# Altium project Altium_008_ESCDesign30ABidirectional.PrjPcb
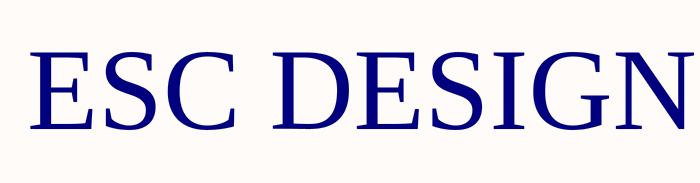
[diagram p0: Introduction.SchDoc]
6 sheets, 69 parts. Net scope: flat (ports and power ports of the same name join across sheets).
Board file: PCB1.PcbDoc
Sheets:
  Introduction.SchDoc
  General Schematics of Design.SchDoc
  Buck Converter and BEC Systems.SchDoc
  MosfetDrivers.SchDoc
  Stm32F103C8T6.SchDoc
  Atmega328PB.SchDoc

## Sheet Introduction.SchDoc
size 420 x 297 mm; Author: Denizhan ALTAY; SheetNumber: 1; SheetTotal: 4

### Notes on the sheet
- ESC DESIGN
- THIS DOCUMENT AND THE DATA DISCLOSED HEREIN OR
- HEREWITH IS THE PROPERTY OF ALTIUM LIMITED AND MAY
- BE FREELY DISTRIBUTED IN WHOLE. NO RIGHTS ARE
- RESERVED OR EXPRESS OR IMPLIED WARANTEE GIVEN.
- Title :
- Size :
- Date :
- A3
- Sheet Number :
- Time :
- Revision :
- Author :
- File :

## Sheet General Schematics of Design.SchDoc
size 420 x 297 mm; SheetNumber: 2; SheetTotal: 6
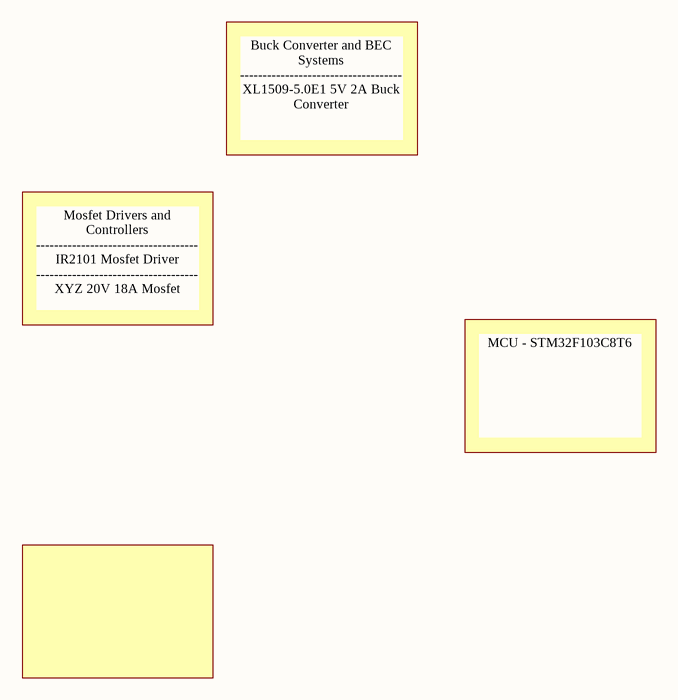
[diagram p1: General Schematics of Design.SchDoc]

### Notes on the sheet
- Buck Converter and BEC Systems ------------------------------------                                                 XL1509-5.0E1 5V 2A Buck Converter
- Mosfet Drivers and Controllers ------------------------------------    IR2101 Mosfet Driver ------------------------------------ XYZ 20V 18A Mosfet
- MCU - STM32F103C8T6
- THIS DOCUMENT AND THE DATA DISCLOSED HEREIN OR
- HEREWITH IS THE PROPERTY OF ALTIUM LIMITED AND MAY
- BE FREELY DISTRIBUTED IN WHOLE. NO RIGHTS ARE
- RESERVED OR EXPRESS OR IMPLIED WARANTEE GIVEN.
- Title :
- Size :
- Date :
- A3
- Sheet Number :
- Time :
- Revision :
- Author :
- File :

## Sheet Buck Converter and BEC Systems.SchDoc
size 420 x 297 mm; Author: Denizhan ALTAY; SheetNumber: 3; SheetTotal: 6
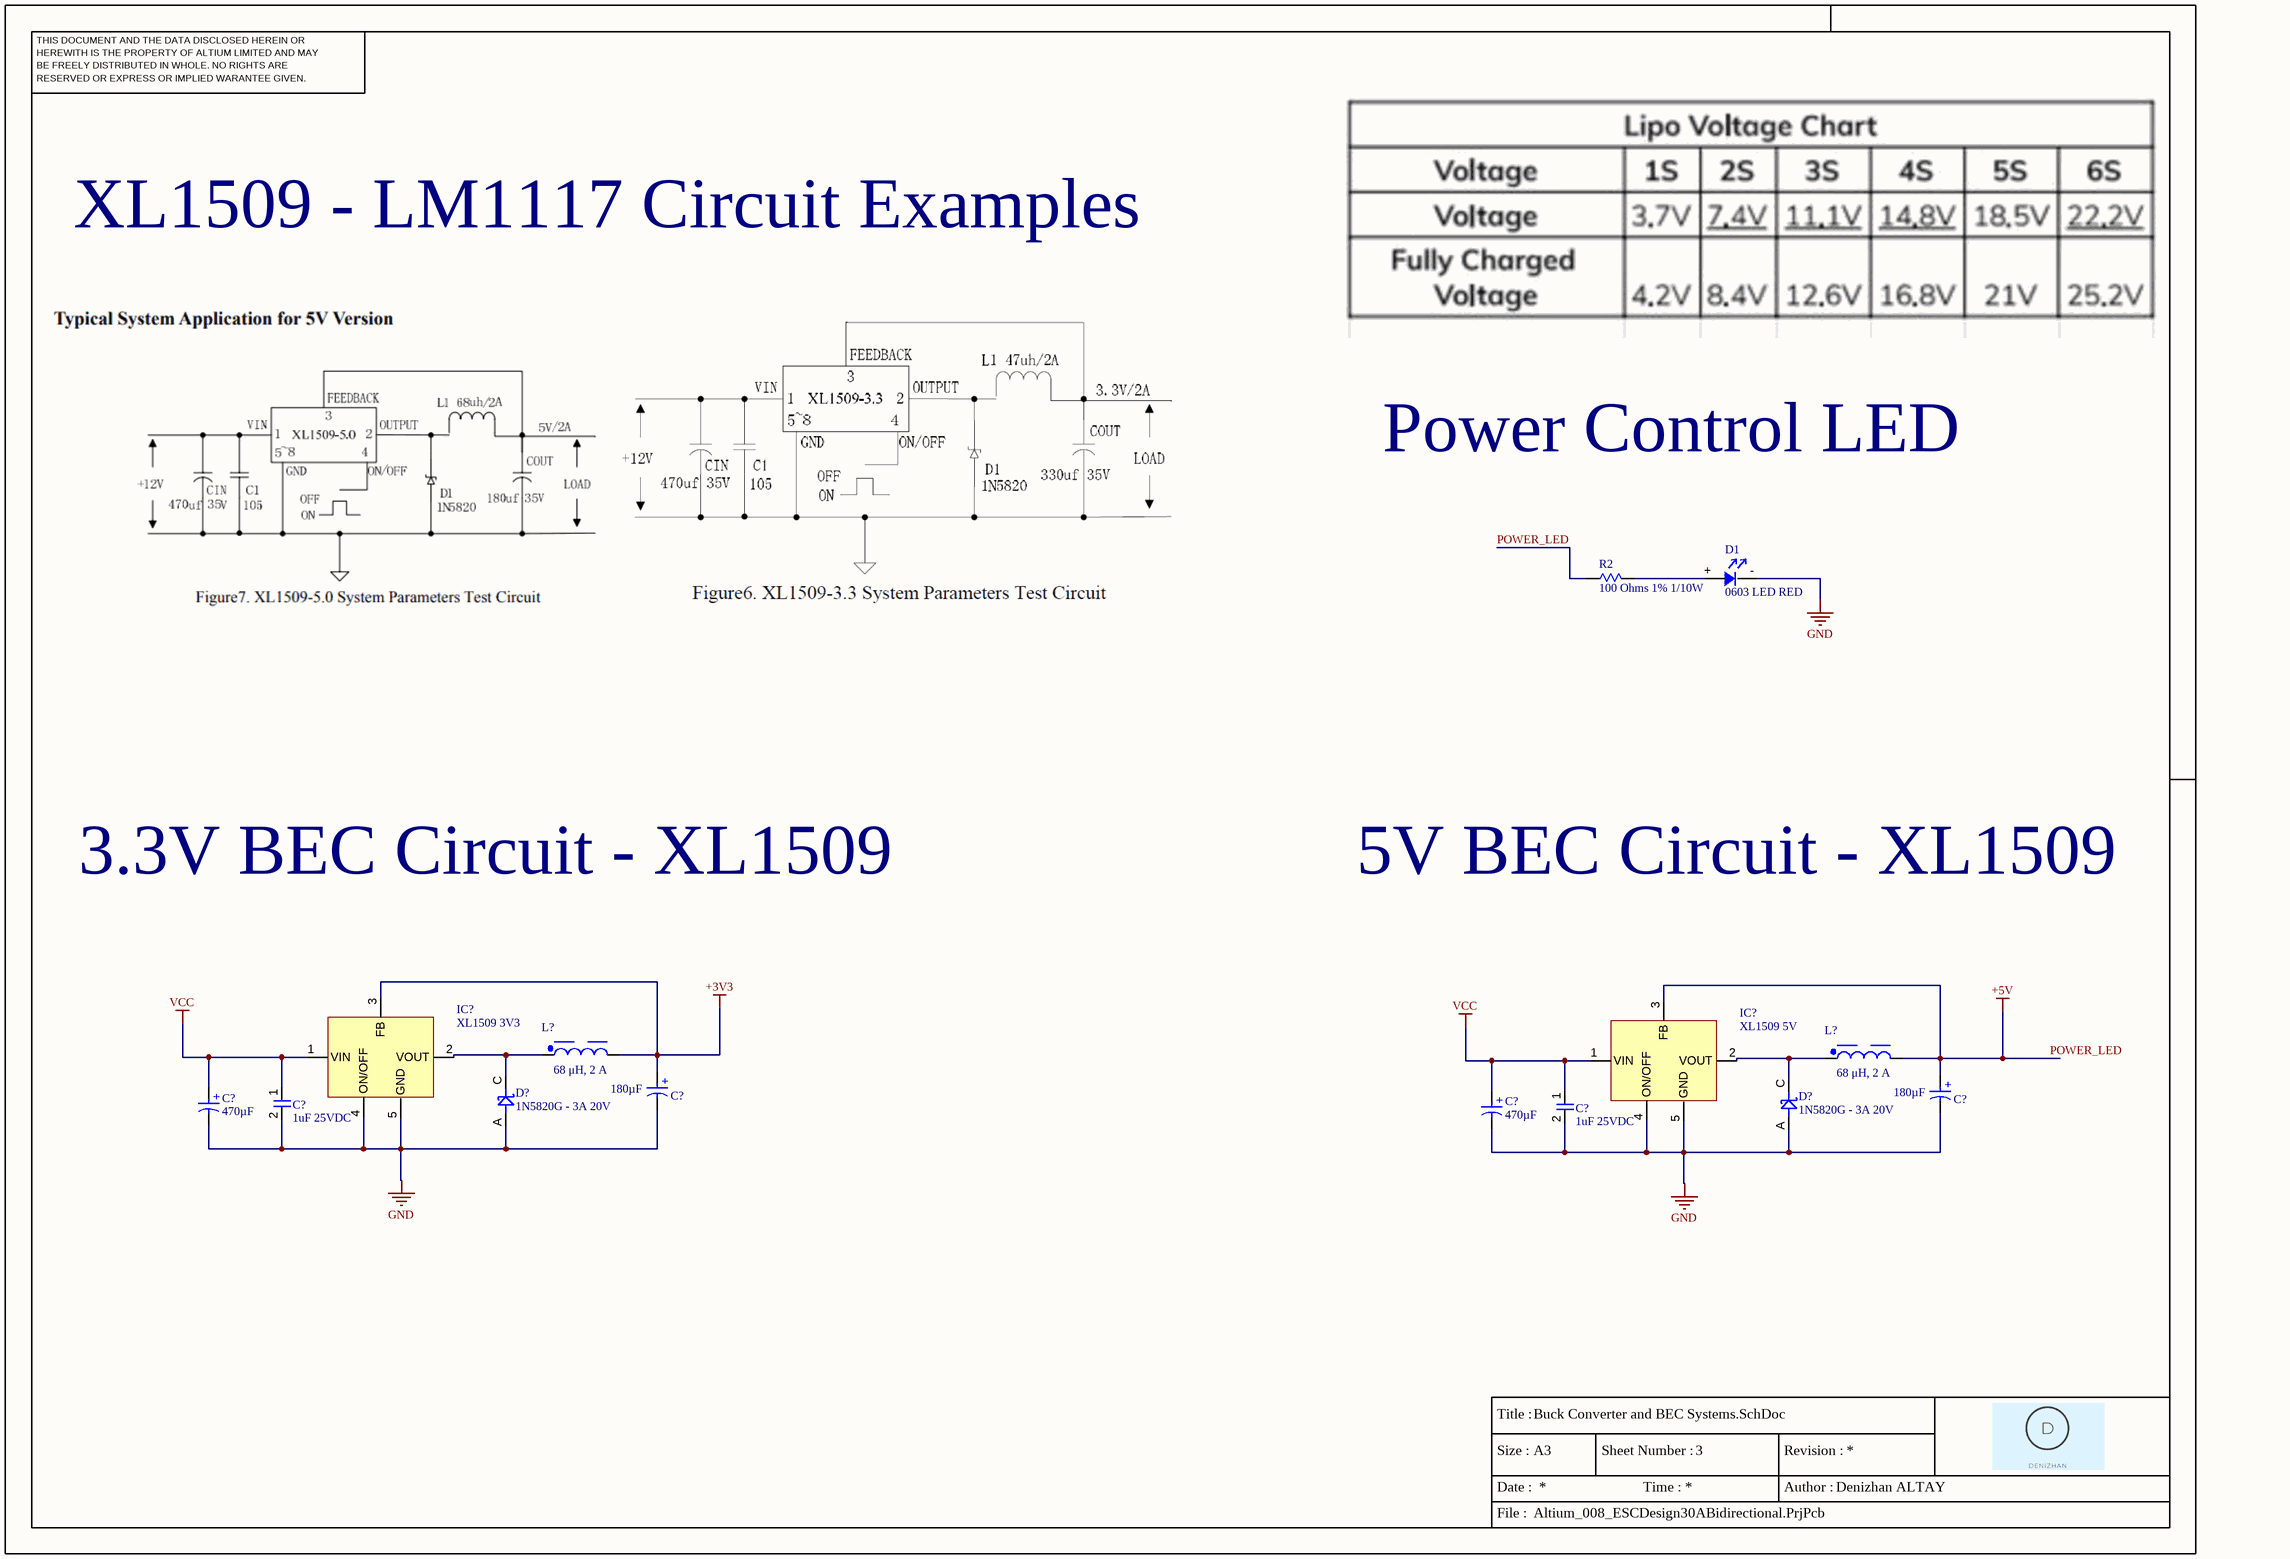
[diagram p2: Buck Converter and BEC Systems.SchDoc]

### Parts
(Parts that share a designator on the sheet are numbered #1, #2 ... from top to bottom, then left to right.)
C?#1  180µF  [WCAP-ATG5_D8H11.5]
C?#2  180µF  [WCAP-ATG5_D8H11.5]
C?#3  470µF  [WCAP-ATG5_D10H16]
C?#4  470µF  [WCAP-ATG5_D10H16]
C?#5  1uF 25VDC  [0603_UnP_Capacitor]
C?#6  1uF 25VDC  [0603_UnP_Capacitor]
D1  0603 LED RED  [LED Diode 0603]
D?#1  1N5820G - 3A 20V  [1n5820g]
D?#2  1N5820G - 3A 20V  [1n5820g]
IC?#1  XL1509 3V3  [XL1509_3.3E1]
IC?#2  XL1509 5V  [XL1509_5E1]
L?#1  68 μH, 2 A  [WE-PD_1260]
L?#2  68 μH, 2 A  [WE-PD_1260]
R2  100 Ohms 1% 1/10W  [0603_Resistor_Case]

### Nets
+3V3: C?#1.1(P) IC?#1.3(FB) L?#1.2  [project net VBAT]
GND: C?#1.2(N) C?#2.2(N) C?#3.2(N) C?#4.2(N) C?#5.2 C?#6.2 D1.- D?#1.A D?#2.A IC?#1.4(ON/OFF) IC?#1.5(GND) IC?#2.4(ON/OFF) IC?#2.5(GND)  [project net VSS-1]
POWER_LED: C?#2.1(P) IC?#2.3(FB) L?#2.2 R2.1  [also labelled +5V]
VCC: C?#3.1(P) C?#4.1(P) C?#5.1 C?#6.1 IC?#1.1(VIN) IC?#2.1(VIN)
NetD1_+: D1.+ R2.2
NetD?#1_C: D?#1.C IC?#1.2(VOUT) L?#1.1
NetD?#2_C: D?#2.C IC?#2.2(VOUT) L?#2.1

### Notes on the sheet
- XL1509 - LM1117 Circuit Examples
- Power Control LED
- 3.3V BEC Circuit - XL1509
- 5V BEC Circuit - XL1509
- THIS DOCUMENT AND THE DATA DISCLOSED HEREIN OR
- HEREWITH IS THE PROPERTY OF ALTIUM LIMITED AND MAY
- BE FREELY DISTRIBUTED IN WHOLE. NO RIGHTS ARE
- RESERVED OR EXPRESS OR IMPLIED WARANTEE GIVEN.
- Title :
- Size :
- Date :
- A3
- Sheet Number :
- Time :
- Revision :
- Author :
- File :
- (in symbol 860020574011) +
- (in symbol 860020575014) +

### Library data of the parts
C?#1 C?#2 = 860020574011: WCAP-ATG5 Aluminum Electrolytic Capacitor, Radial, THT, D8 x H11.5mm, 180µF, 35V; Manufacturer: Wurth Elektronik; Capacitance Tolerance: +/-20%; Dissipation Factor: 12%; Endurance: 2000h; Leakage Current: 63µA; Ripple Current: 225mA; Technical Reference: ATDE115181M035DSPA7B000; Manufacturer Part Number: 860020574011; Category: Aluminum Electrolytic Capacitors; Match Code: WCAP-ATG5; ComponentLink1Description: Website Link; ComponentLink1URL: https://www.we-online.com/redexpert/article/860020574011?ad; ComponentLink2Description: Datasheet Link; ComponentLink2URL: https://www.we-online.com/redexpert/spec/860020574011?ad; Operating Temperature Max: 105°C; Operating Temperature Min: -40°C; Packaging: Ammo Pack; Height: 11.5mm; Diameter: 8mm; Capacitance: 180µF; Rated Voltage (DC): 35V; Package: THT; Library Ref: Capacitors; Capacitor Type: Electrolytic
C?#3 C?#4 = 860020575014: WCAP-ATG5 Aluminum Electrolytic Capacitor, Radial, THT, D10 x H16mm, 470µF, 35V; Manufacturer: Wurth Elektronik; Capacitance Tolerance: +/-20%; Dissipation Factor: 12%; Endurance: 2000h; Leakage Current: 164.5µA; Ripple Current: 520mA; Technical Reference: ATDF160471M035DSPAAB000; Manufacturer Part Number: 860020575014; Category: Aluminum Electrolytic Capacitors; Match Code: WCAP-ATG5; ComponentLink1Description: Website Link; ComponentLink1URL: https://www.we-online.com/redexpert/article/860020575014?ad; ComponentLink2Description: Datasheet Link; ComponentLink2URL: https://www.we-online.com/redexpert/spec/860020575014?ad; Operating Temperature Max: 105°C; Operating Temperature Min: -40°C; Packaging: Ammo Pack; Height: 16mm; Diameter: 10mm; Capacitance: 470µF; Rated Voltage (DC): 35V; Package: THT; Library Ref: Capacitors; Capacitor Type: Electrolytic
C?#5 C?#6 = MCF03KTB250105 - MLCC (1608) 0603 1uF 25VDC ±10% X7R: Manufacturer: VIKING; Part Number: MCF03MTX250106; Capacitor Type: Ceramic; Library Ref: Capacitors; Package / Case: 0603; ComponentLink1Description: New link; ComponentLink1URL: https://www.ozdisan.com/passive-components/resistors/smt-smd-and-chip-resistors/PS03W4F1003T5E/592727; Max Working Voltage: 25VDC; Availability: Available; Package: SMD; Capacitance: 1uF
D1 = 0603 LED RED: Type: SMD; Library Ref: LED; Package / Case: 0603; Color: Red
D?#1 D?#2 = 1N5820G: 1N5820G -DIODE SWITCHING Single 3A 20V THT; Type: Schottky; Library Ref: Diodes; Diode Types: Switching; Availability: Available; Package: THT; Working Voltage (Max): 20V; Rated Current (Max): 3A
IC?#1 = XL1509-3V3: Voltage Regulator; Manufacturer: XLSEMI; Regulator Type: Buck; Output Voltage (Max): 3.3V; Output Current (Max): 2A; Input Voltage (Min): 5V; Input Voltage (Max): 40V; Library Ref: Voltage Regulators; Availability: Available; Package: SMD; Output Voltage: 3.3V
IC?#2 = XL1509-5V: Voltage Regulator; Manufacturer: XLSEMI; Output Current (Max): 2A; Input Voltage (Max): 40V; Regulator Type: Buck; Library Ref: Voltage Regulators; Output Voltage (Max): 5V; Input Voltage (Min): 5V; Availability: Available; Package: SMD
L?#1 L?#2 = 744771168: WE-PD SMT Power Inductor, size 1260, 68 μH, 2 A, 105 mΩ; Manufacturer: Wurth Elektronik; Case/Size Code: 1260; DC Resistance: 86 mΩ; DC Resistance Max: 105 mΩ; Inductance: 68 μH; Rated Current: 2 A; Saturation Current: 2.2 A; Self Resonant Frequency: 7.6 MHz; Type: Standard; Manufacturer Part Number: 744771168; Category: Power Inductors; Match Code: WE-PD; ComponentLink1Description: Website Link; ComponentLink1URL: https://www.we-online.com/redexpert/article/744771168?ad; ComponentLink2Description: Datasheet Link; ComponentLink2URL: https://www.we-online.com/redexpert/spec/744771168?ad; Min Operating Temperature: -40 °C; Max Operating Temperature: 125 °C; Packaging: Tape and Reel; Length: 12 mm; Width: 12 mm; Height: 6 mm; Library Ref: Inductors; Package: SMD
R2 = CQ03SAF1000T5E - 0603 100 Ohms 1% 1/10W AUTOMOTIV: Manufacturer: ROYALOHM; Working Voltage (Max): 75V; Library Ref: Resistors; Package / Case: 0603; Power (Watts): 1/10W; Resistor Value: 100 Ohms; Part Number: CQ03SAF1000T5E; ComponentLink1Description: New link; ComponentLink1URL: https://www.ozdisan.com/passive-components/resistors/smt-smd-and-chip-resistors/PS03W4F1003T5E/592727

## Sheet MosfetDrivers.SchDoc
size 420 x 297 mm; Author: Denizhan ALTAY; SheetNumber: 4; SheetTotal: 6
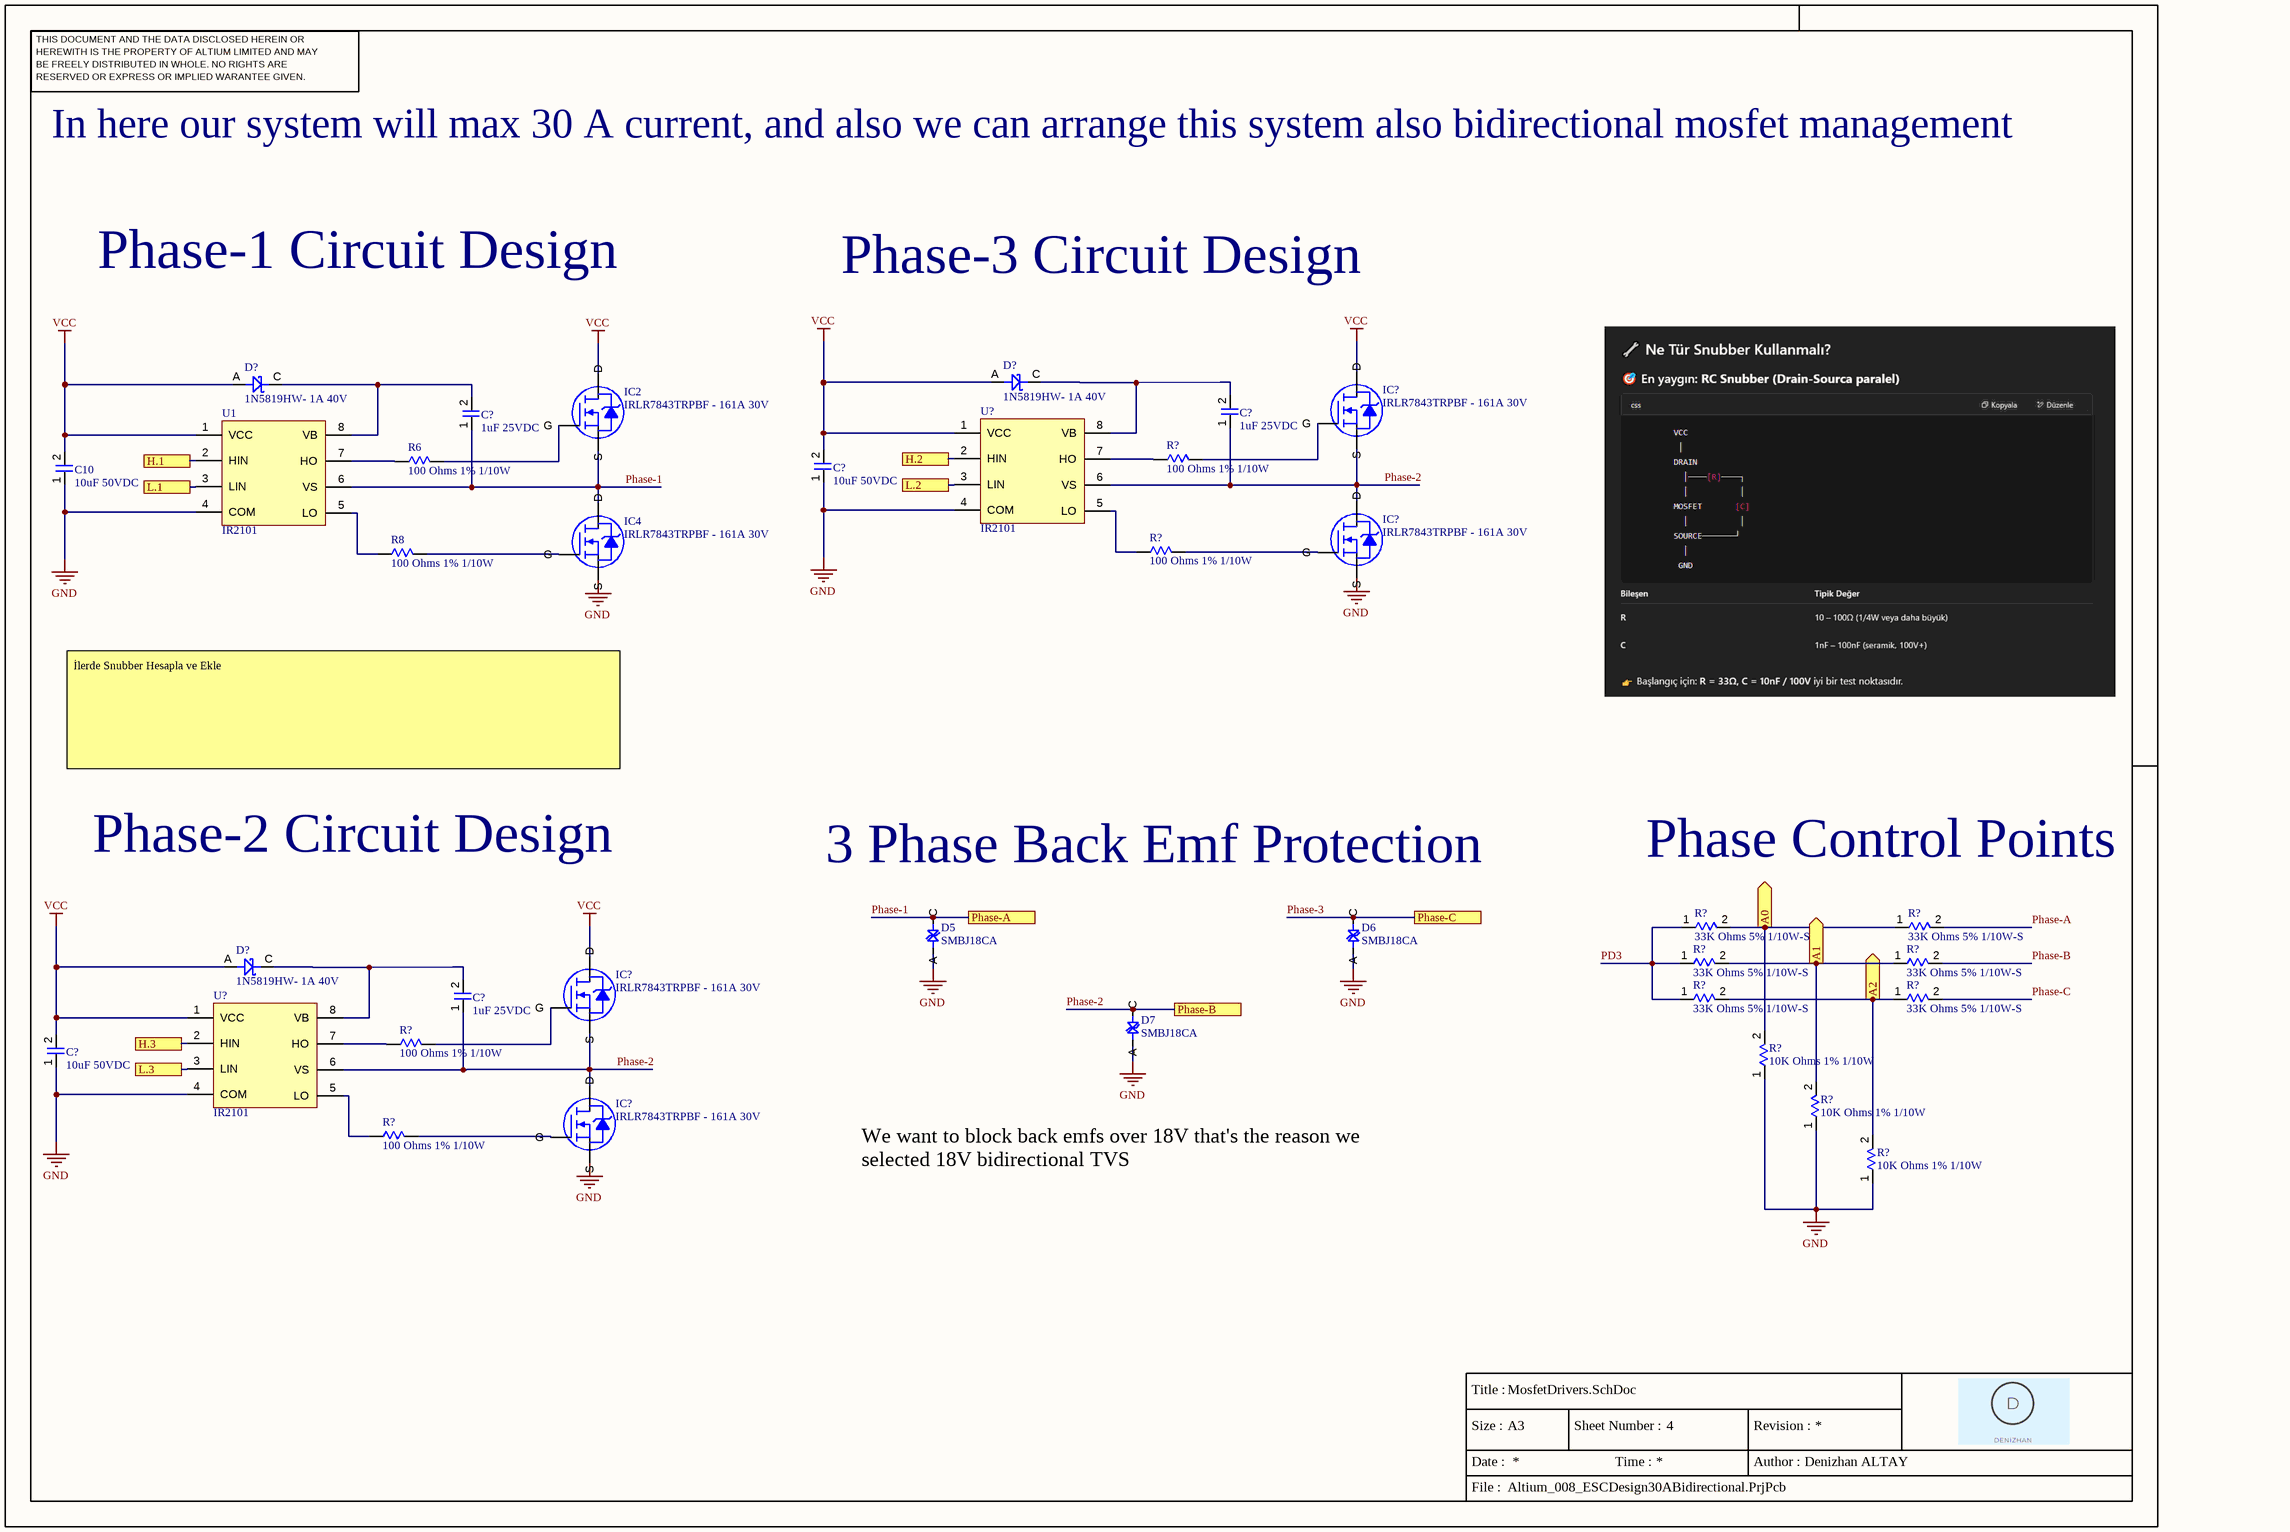
[diagram p3: MosfetDrivers.SchDoc]

### Parts
(Parts that share a designator on the sheet are numbered #1, #2 ... from top to bottom, then left to right.)
C10  10uF 50VDC  [0805_Capacitor_Special_CC0805KKX7R9BB106]
C?#7  1uF 25VDC  [0603_UnP_Capacitor]
C?#8  1uF 25VDC  [0603_UnP_Capacitor]
C?#9  10uF 50VDC  [0805_Capacitor_Special_CC0805KKX7R9BB106]
C?#10  1uF 25VDC  [0603_UnP_Capacitor]
C?#11  10uF 50VDC  [0805_Capacitor_Special_CC0805KKX7R9BB106]
D5  SMBJ18CA  [SMBJ18CA-TKS]
D6  SMBJ18CA  [SMBJ18CA-TKS]
D7  SMBJ18CA  [SMBJ18CA-TKS]
D?#3  1N5819HW- 1A 40V  [1N5819HW-7-F]
D?#4  1N5819HW- 1A 40V  [1N5819HW-7-F]
D?#5  1N5819HW- 1A 40V  [1N5819HW-7-F]
IC2  IRLR7843TRPBF - 161A 30V  [IRLR7843_DPAK229P991X239-3N]
IC4  IRLR7843TRPBF - 161A 30V  [IRLR7843_DPAK229P991X239-3N]
IC?#3  IRLR7843TRPBF - 161A 30V  [IRLR7843_DPAK229P991X239-3N]
IC?#4  IRLR7843TRPBF - 161A 30V  [IRLR7843_DPAK229P991X239-3N]
IC?#5  IRLR7843TRPBF - 161A 30V  [IRLR7843_DPAK229P991X239-3N]
IC?#6  IRLR7843TRPBF - 161A 30V  [IRLR7843_DPAK229P991X239-3N]
R6  100 Ohms 1% 1/10W  [0603_Resistor_Case]
R8  100 Ohms 1% 1/10W  [0603_Resistor_Case]
R?#1  100 Ohms 1% 1/10W  [0603_Resistor_Case]
R?#2  100 Ohms 1% 1/10W  [0603_Resistor_Case]
R?#3  33K Ohms 5% 1/10W-S  [0603_Resistor_Case]
R?#4  33K Ohms 5% 1/10W-S  [0603_Resistor_Case]
R?#5  33K Ohms 5% 1/10W-S  [0603_Resistor_Case]
R?#6  33K Ohms 5% 1/10W-S  [0603_Resistor_Case]
R?#7  33K Ohms 5% 1/10W-S  [0603_Resistor_Case]
R?#8  33K Ohms 5% 1/10W-S  [0603_Resistor_Case]
R?#9  100 Ohms 1% 1/10W  [0603_Resistor_Case]
R?#10  10K Ohms 1% 1/10W  [0603_Resistor_Case]
R?#11  10K Ohms 1% 1/10W  [0603_Resistor_Case]
R?#12  100 Ohms 1% 1/10W  [0603_Resistor_Case]
R?#13  10K Ohms 1% 1/10W  [0603_Resistor_Case]
U1  IR2101  [IR2101_SOIC127P600X175-8N]
U?#1  IR2101  [IR2101_SOIC127P600X175-8N]
U?#2  IR2101  [IR2101_SOIC127P600X175-8N]

### Ports
A0 (out), A1 (out), A2 (out), H.1, H.2, H.3, L.1, L.2, L.3, Phase-A, Phase-B, Phase-C

### Nets
GND: C10.1 C?#9.1 C?#11.1 D5.2(A) D6.2(A) D7.2(A) IC4.3(S) IC?#4.3(S) IC?#6.3(S) R?#10.1 R?#11.1 R?#13.1 U1.4(COM) U?#1.4(COM) U?#2.4(COM)  [project net VSS-1]
VCC: C10.2 C?#9.2 C?#11.2 D?#3.A D?#4.A D?#5.A IC2.4(D) IC?#3.4(D) IC?#5.4(D) U1.1(VCC) U?#1.1(VCC) U?#2.1(VCC)
PD3: R?#3.1 R?#5.1 R?#7.1
Phase-1: C?#7.1 D5.1(C) IC2.3(S) IC4.4(D) U1.6(VS) ; port Phase-A
Phase-2: C?#8.1 C?#10.1 D7.1(C) IC?#3.3(S) IC?#4.4(D) IC?#5.3(S) IC?#6.4(D) U?#1.6(VS) U?#2.6(VS) ; port Phase-B
Phase-3: D6.1(C) ; port Phase-C
Phase-A: R?#4.2
Phase-B: R?#6.2
Phase-C: R?#8.2
NetC?#7_2: C?#7.2 D?#3.C U1.8(VB)
NetC?#8_2: C?#8.2 D?#4.C U?#1.8(VB)
NetC?#10_2: C?#10.2 D?#5.C U?#2.8(VB)
NetIC2_1: IC2.1(G) R6.2
NetIC4_1: IC4.1(G) R8.2
NetIC?#3_1: IC?#3.1(G) R?#1.2
NetIC?#4_1: IC?#4.1(G) R?#2.2
NetIC?#5_1: IC?#5.1(G) R?#9.2
NetIC?#6_1: IC?#6.1(G) R?#12.2
NetR6_1: R6.1 U1.7(HO)
NetR8_1: R8.1 U1.5(LO)
NetR?#1_1: R?#1.1 U?#1.7(HO)
NetR?#2_1: R?#2.1 U?#1.5(LO)
NetR?#3_2: R?#3.2 R?#4.1 R?#10.2 ; port A0
NetR?#5_2: R?#5.2 R?#6.1 R?#11.2 ; port A1
NetR?#7_2: R?#7.2 R?#8.1 R?#13.2 ; port A2
NetR?#9_1: R?#9.1 U?#2.7(HO)
NetR?#12_1: R?#12.1 U?#2.5(LO)
NetU1_2: U1.2(HIN) ; port H.1
NetU1_3: U1.3(LIN) ; port L.1
NetU?#1_2: U?#1.2(HIN) ; port H.2
NetU?#1_3: U?#1.3(LIN) ; port L.2
NetU?#2_2: U?#2.2(HIN) ; port H.3
NetU?#2_3: U?#2.3(LIN) ; port L.3

### Notes on the sheet
- In here our system will max 30 A current, and also we can arrange this system also bidirectional mosfet management
- Phase-1 Circuit Design
- Phase-3 Circuit Design
- İlerde Snubber Hesapla ve Ekle
- Phase-2 Circuit Design
- 3 Phase Back Emf Protection
- Phase Control Points
- We want to block back emfs over 18V that's the reason we selected 18V bidirectional TVS
- THIS DOCUMENT AND THE DATA DISCLOSED HEREIN OR
- HEREWITH IS THE PROPERTY OF ALTIUM LIMITED AND MAY
- BE FREELY DISTRIBUTED IN WHOLE. NO RIGHTS ARE
- RESERVED OR EXPRESS OR IMPLIED WARANTEE GIVEN.
- Title :
- Size :
- Date :
- A3
- Sheet Number :
- Time :
- Revision :
- Author :
- File :

### Library data of the parts
C10 C?#9 C?#11 = CC0805KKX7R9BB106 - MLCC 0805 10uF 50VDC ±10% X7R: Manufacturer: YAGEO; Capacitor Type: Unpolarized; Library Ref: Capacitors; Package / Case: 0805; Capacitor Value: 10uF; Part Number: CC0805KKX7R9BB106; ComponentLink1Description: New link; ComponentLink1URL: https://www.ozdisan.com/passive-components/capacitors/smt-smd-and-mlcc-capacitors/CL10B392KB8NNNC/26336; Max Working Voltage: 50VDC
C?#7 C?#8 C?#10 = MCF03KTB250105 - MLCC (1608) 0603 1uF 25VDC ±10% X7R: Manufacturer: VIKING; Part Number: MCF03MTX250106; Capacitor Type: Ceramic; Max Working Voltage: 25V; Capacitance: 1µF; Case/Size Code: 0603; Library Ref: Capacitors; ComponentLink1Description: New link; ComponentLink1URL: https://www.ozdisan.com/passive-components/resistors/smt-smd-and-chip-resistors/PS03W4F1003T5E/592727; Availability: Available; Package: SMD
D5-D7 = SMBJ18CA-TKS - DIODE TVS 600W 18V DO214AA: SMBJ18CA-TKS - DIODE TVS 600W 18V DO214AA (SMB) SMT; MF: THINKING ELECTRONIC; Diode Direction: Bidirectional; Package: SMD; Price: None; Library Ref: Diodes; MP: SMBJ18CA-TKS; Availability: Available; Type: TVS
D?#3-D?#5 = 1N5819HW-7-F: Diode Schottky 40 V 1A Surface Mount SOD-123; Diode Types: Switching; Working Voltage (Max): 4; Library Ref: Diodes; Availability: Available; Package: SMD; Rated Current (Max): 1A; Type: Schottky
IC2 IC4 IC?#3-IC?#6 = IRLR7843TRPBF - MOSFET DIS.161A 30V N-CH TO252(DPAK) HEXFET SMT: Mosfet Type: N; Library Ref: Mosfets; Package / Case: D-Pack
R6 R8 R?#1 R?#2 R?#9 R?#12 = CQ03SAF1000T5E - 0603 100 Ohms 1% 1/10W AUTOMOTIV: as R2 on sheet Buck Converter and BEC Systems; Library Ref: Resistors; Package / Case: 0603; Power (Watts): 1/10W; Resistor Value: 100 Ohms; Part Number: CQ03SAF1000T5E; ComponentLink1Description: New link; ComponentLink1URL: https://www.ozdisan.com/passive-components/resistors/smt-smd-and-chip-resistors/PS03W4F1003T5E/592727
R?#3-R?#8 = 0603SAJ0333T5E - RES. 0603 33K Ohms 5% 1/10W-S 100PPM: 0603SAJ0333T5E - RES.(1608) 0603 33K Ohms 5% 1/10W-S 100PPM; Manufacturer: ROYALOHM; Power (Watts): 1/10W; Working Voltage (Max): 75V; Library Ref: Resistors; Package / Case: 0603; Resistor Value: 33K Ohms; Part Number: 0603SAJ0333T5E; ComponentLink1Description: New link; ComponentLink1URL: https://www.ozdisan.com/passive-components/resistors/smt-smd-and-chip-resistors/PS03W4F1003T5E/592727
R?#10 R?#11 R?#13 = RC0603FR-0710KL - 0603 10K Ohms 1% 1/10W 100PPM: Manufacturer: HOTTECH; Part Number: PS03W4F1003T5E; Max Working Voltage: 75V; Library Ref: Resistors; Package / Case: 0603; Power (Watts): 1/10W; Resistor Value: 10K Ohms; ComponentLink1Description: New link; ComponentLink1URL: https://www.ozdisan.com/passive-components/resistors/smt-smd-and-chip-resistors/PS03W4F1003T5E/592727
U1 U?#1 U?#2 = IR2101: High Speed power MOSFET and IGBT driver; Library Ref: Mosfet Controllers

## Sheet Stm32F103C8T6.SchDoc
size 420 x 297 mm; SheetNumber: 5; SheetTotal: 6
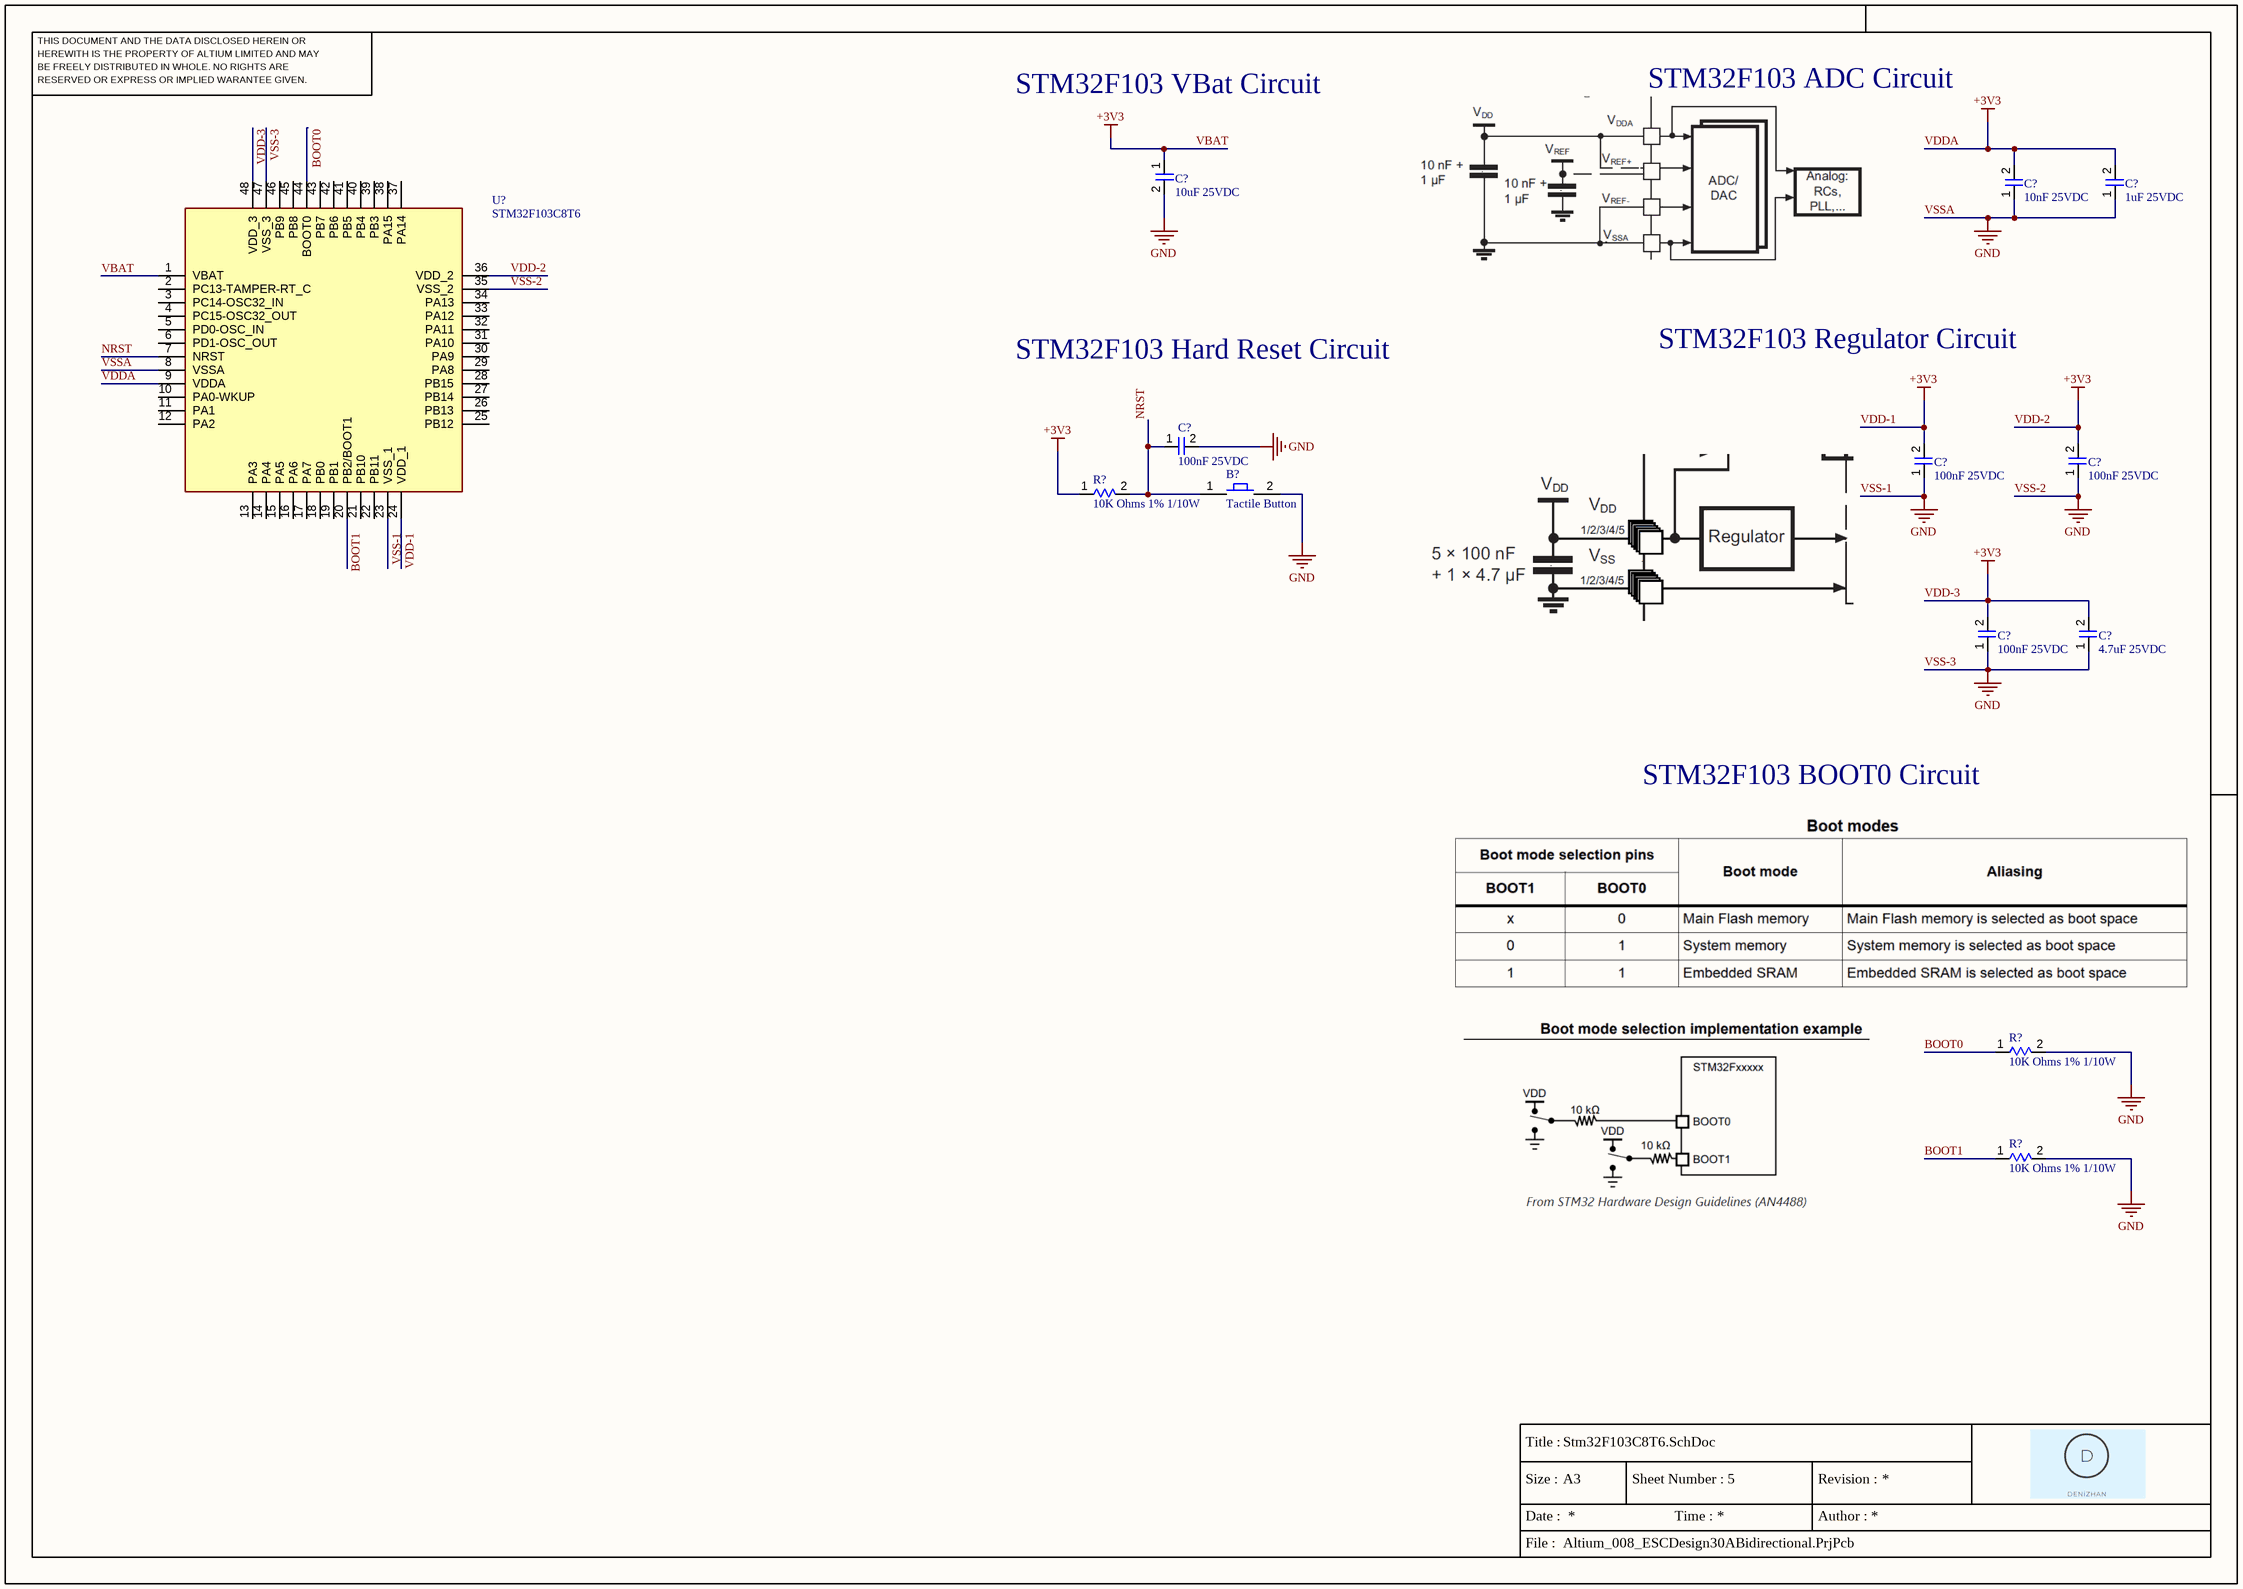
[diagram p4: Stm32F103C8T6.SchDoc]

### Parts
(Parts that share a designator on the sheet are numbered #1, #2 ... from top to bottom, then left to right.)
B?  Tactile Button  [Tactal Switch - SMD (6mm x 6mm x 12mm)]
C?#12  10uF 25VDC  [0603_UnP_Capacitor]
C?#13  10nF 25VDC  [0603_UnP_Capacitor]
C?#14  1uF 25VDC  [0603_UnP_Capacitor]
C?#15  100nF 25VDC  [0603_UnP_Capacitor]
C?#16  100nF 25VDC  [0603_UnP_Capacitor]
C?#17  100nF 25VDC  [0603_UnP_Capacitor]
C?#18  100nF 25VDC  [0603_UnP_Capacitor]
C?#19  4.7uF 25VDC  [0603_UnP_Capacitor]
R?#14  10K Ohms 1% 1/10W  [0603_Resistor_Case]
R?#15  10K Ohms 1% 1/10W  [0603_Resistor_Case]
R?#16  10K Ohms 1% 1/10W  [0603_Resistor_Case]
U?#3  STM32F103C8T6  [STM32F103-48N]

### Nets
VBAT: C?#12.1 C?#13.2 C?#14.2 C?#16.2 C?#17.2 C?#18.2 C?#19.2 R?#14.1 U?#3.1(VBAT) U?#3.9(VDDA) U?#3.24(VDD_1) U?#3.36(VDD_2) U?#3.48(VDD_3)  [also labelled +3V3, VDD-1, VDD-2, VDD-3, VDDA]
VSS-1: B?.2 C?#12.2 C?#13.1 C?#14.1 C?#15.2 C?#16.1 C?#17.1 C?#18.1 C?#19.1 R?#15.2 R?#16.2 U?#3.8(VSSA) U?#3.23(VSS_1) U?#3.35(VSS_2) U?#3.47(VSS_3)  [also labelled GND, VSS-2, VSS-3, VSSA]
BOOT0: R?#15.1 U?#3.44(BOOT0)
BOOT1: R?#16.1 U?#3.20(PB2/BOOT1)
NRST: B?.1 C?#15.1 R?#14.2 U?#3.7(NRST)

Not connected (* = marked no-connect by the designer): U?#3 2(PC13-TAMPER-RT_C) 3(PC14-OSC32_IN) 4(PC15-OSC32_OUT) 5(PD0-OSC_IN) 6(PD1-OSC_OUT) 10(PA0-WKUP) 11(PA1) 12(PA2) 13(PA3) 14(PA4) 15(PA5) 16(PA6) 17(PA7) 18(PB0) 19(PB1) 21(PB10) 22(PB11) 25(PB12) 26(PB13) 27(PB14) 28(PB15) 29(PA8) 30(PA9) 31(PA10) 32(PA11) 33(PA12) 34(PA13) 37(PA14) 38(PA15) 39(PB3) 40(PB4) 41(PB5) 42(PB6) 43(PB7) 45(PB8) 46(PB9)

### Notes on the sheet
- STM32F103 VBat Circuit
- STM32F103 ADC Circuit
- STM32F103 Hard Reset Circuit
- STM32F103 Regulator Circuit
- STM32F103 BOOT0 Circuit
- THIS DOCUMENT AND THE DATA DISCLOSED HEREIN OR
- HEREWITH IS THE PROPERTY OF ALTIUM LIMITED AND MAY
- BE FREELY DISTRIBUTED IN WHOLE. NO RIGHTS ARE
- RESERVED OR EXPRESS OR IMPLIED WARANTEE GIVEN.
- Title :
- Size :
- Date :
- A3
- Sheet Number :
- Time :
- Revision :
- Author :
- File :

### Library data of the parts
B? = Tactile Button: Basic Push Button SMD (6mm x 6mm x 12mm); Button Type: Tactal; Library Ref: Button; Button Size (From Bottom): 12mm; Availability: Available; Package: SMD
C?#12 = MCF03MTX250106 - MLCC 0603 10uF 25VDC ±20% X5R: MCF03MTX250106 - MLCC (1608) 0603 10uF 25VDC ±20% X5R; Manufacturer: VIKING; Capacitor Type: Ceramic; Capacitance: 10µF; Case/Size Code: 0603; Library Ref: Capacitors; Part Number: MCF03MTX250106; ComponentLink1Description: New link; ComponentLink1URL: https://www.ozdisan.com/passive-components/resistors/smt-smd-and-chip-resistors/PS03W4F1003T5E/592727; Max Working Voltage: 25VDC; Availability: Available; Package: SMD
C?#13 = CC0603KRX7R8BB103 - MLCC (1608) 0603 10nF 25VDC ±10% X7R: Manufacturer: YAGEO; Part Number: CL10B105KA8NNNC; Capacitor Type: Unpolarized; Max Working Voltage: 25V; Case/Size Code: 0603; Library Ref: Capacitors; ComponentLink1Description: New link; ComponentLink1URL: https://www.ozdisan.com/passive-components/resistors/smt-smd-and-chip-resistors/PS03W4F1003T5E/592727; Availability: Available; Package: SMD; Capacitance: 10nF
C?#14 = CL10B105KA8NNNC - MLCC (1608) 0603 1uF 25VDC ±10% X7R: Manufacturer: SAMSUNG; Capacitor Type: Unpolarized; Max Working Voltage: 25V; Case/Size Code: 0603; Library Ref: Capacitors; Part Number: CL10B105KA8NNNC; ComponentLink1Description: New link; ComponentLink1URL: https://www.ozdisan.com/passive-components/resistors/smt-smd-and-chip-resistors/PS03W4F1003T5E/592727; Availability: Available; Package: SMD; Capacitance: 1uF
C?#15-C?#18 = MCF03KTB250104 - MLCC (1608) 0603 100nF 25VDC ±10% X7R: Manufacturer: SAMSUNG; Capacitor Type: Ceramic; Max Working Voltage: 25V; Case/Size Code: 0603; Library Ref: Capacitors; Part Number: MCF03KTB250104; ComponentLink1Description: New link; ComponentLink1URL: https://www.ozdisan.com/passive-components/capacitors/smt-smd-and-mlcc-capacitors/CL10B392KB8NNNC/26336; Availability: Available; Package: SMD; Capacitance: 100nF
C?#19 = CL10A475KA8NQNC - MLCC (1608) 0603 4.7uF 25VDC ±10% X5R: Manufacturer: SAMSUNG; Capacitor Type: Unpolarized; Max Working Voltage: 25V; Capacitance: 4.7µF; Case/Size Code: 0603; Library Ref: Capacitors; Part Number: CL10A475KA8NQNC; ComponentLink1Description: New link; ComponentLink1URL: https://www.ozdisan.com/passive-components/capacitors/smt-smd-and-mlcc-capacitors/CL10B392KB8NNNC/26336; Availability: Available; Package: SMD
R?#14-R?#16 = RC0603FR-0710KL - 0603 10K Ohms 1% 1/10W 100PPM: Manufacturer: HOTTECH; Part Number: PS03W4F1003T5E; Max Working Voltage: 75V; Case/Size Code: 0603; Library Ref: Resistors; Power (Watts): 1/10W; Resistor Value: 10K Ohms; ComponentLink1Description: New link; ComponentLink1URL: https://www.ozdisan.com/passive-components/resistors/smt-smd-and-chip-resistors/PS03W4F1003T5E/592727; Availability: Available; Package: SMD
U?#3 = STM32F103C8T6: ARM® Cortex®-M3 STM32F1 Microcontroller IC 32-Bit 72MHz 64KB (64K x 8) FLASH 48-LQFP (7x7); Manufacturer: STMicroelectronics; Library Ref: Microprocessors; Pin Count: 48; Availability: Available; Package: SMD

## Sheet Atmega328PB.SchDoc
size 420 x 297 mm; Author: Denizhan ALTAY; SheetNumber: 6; SheetTotal: 5
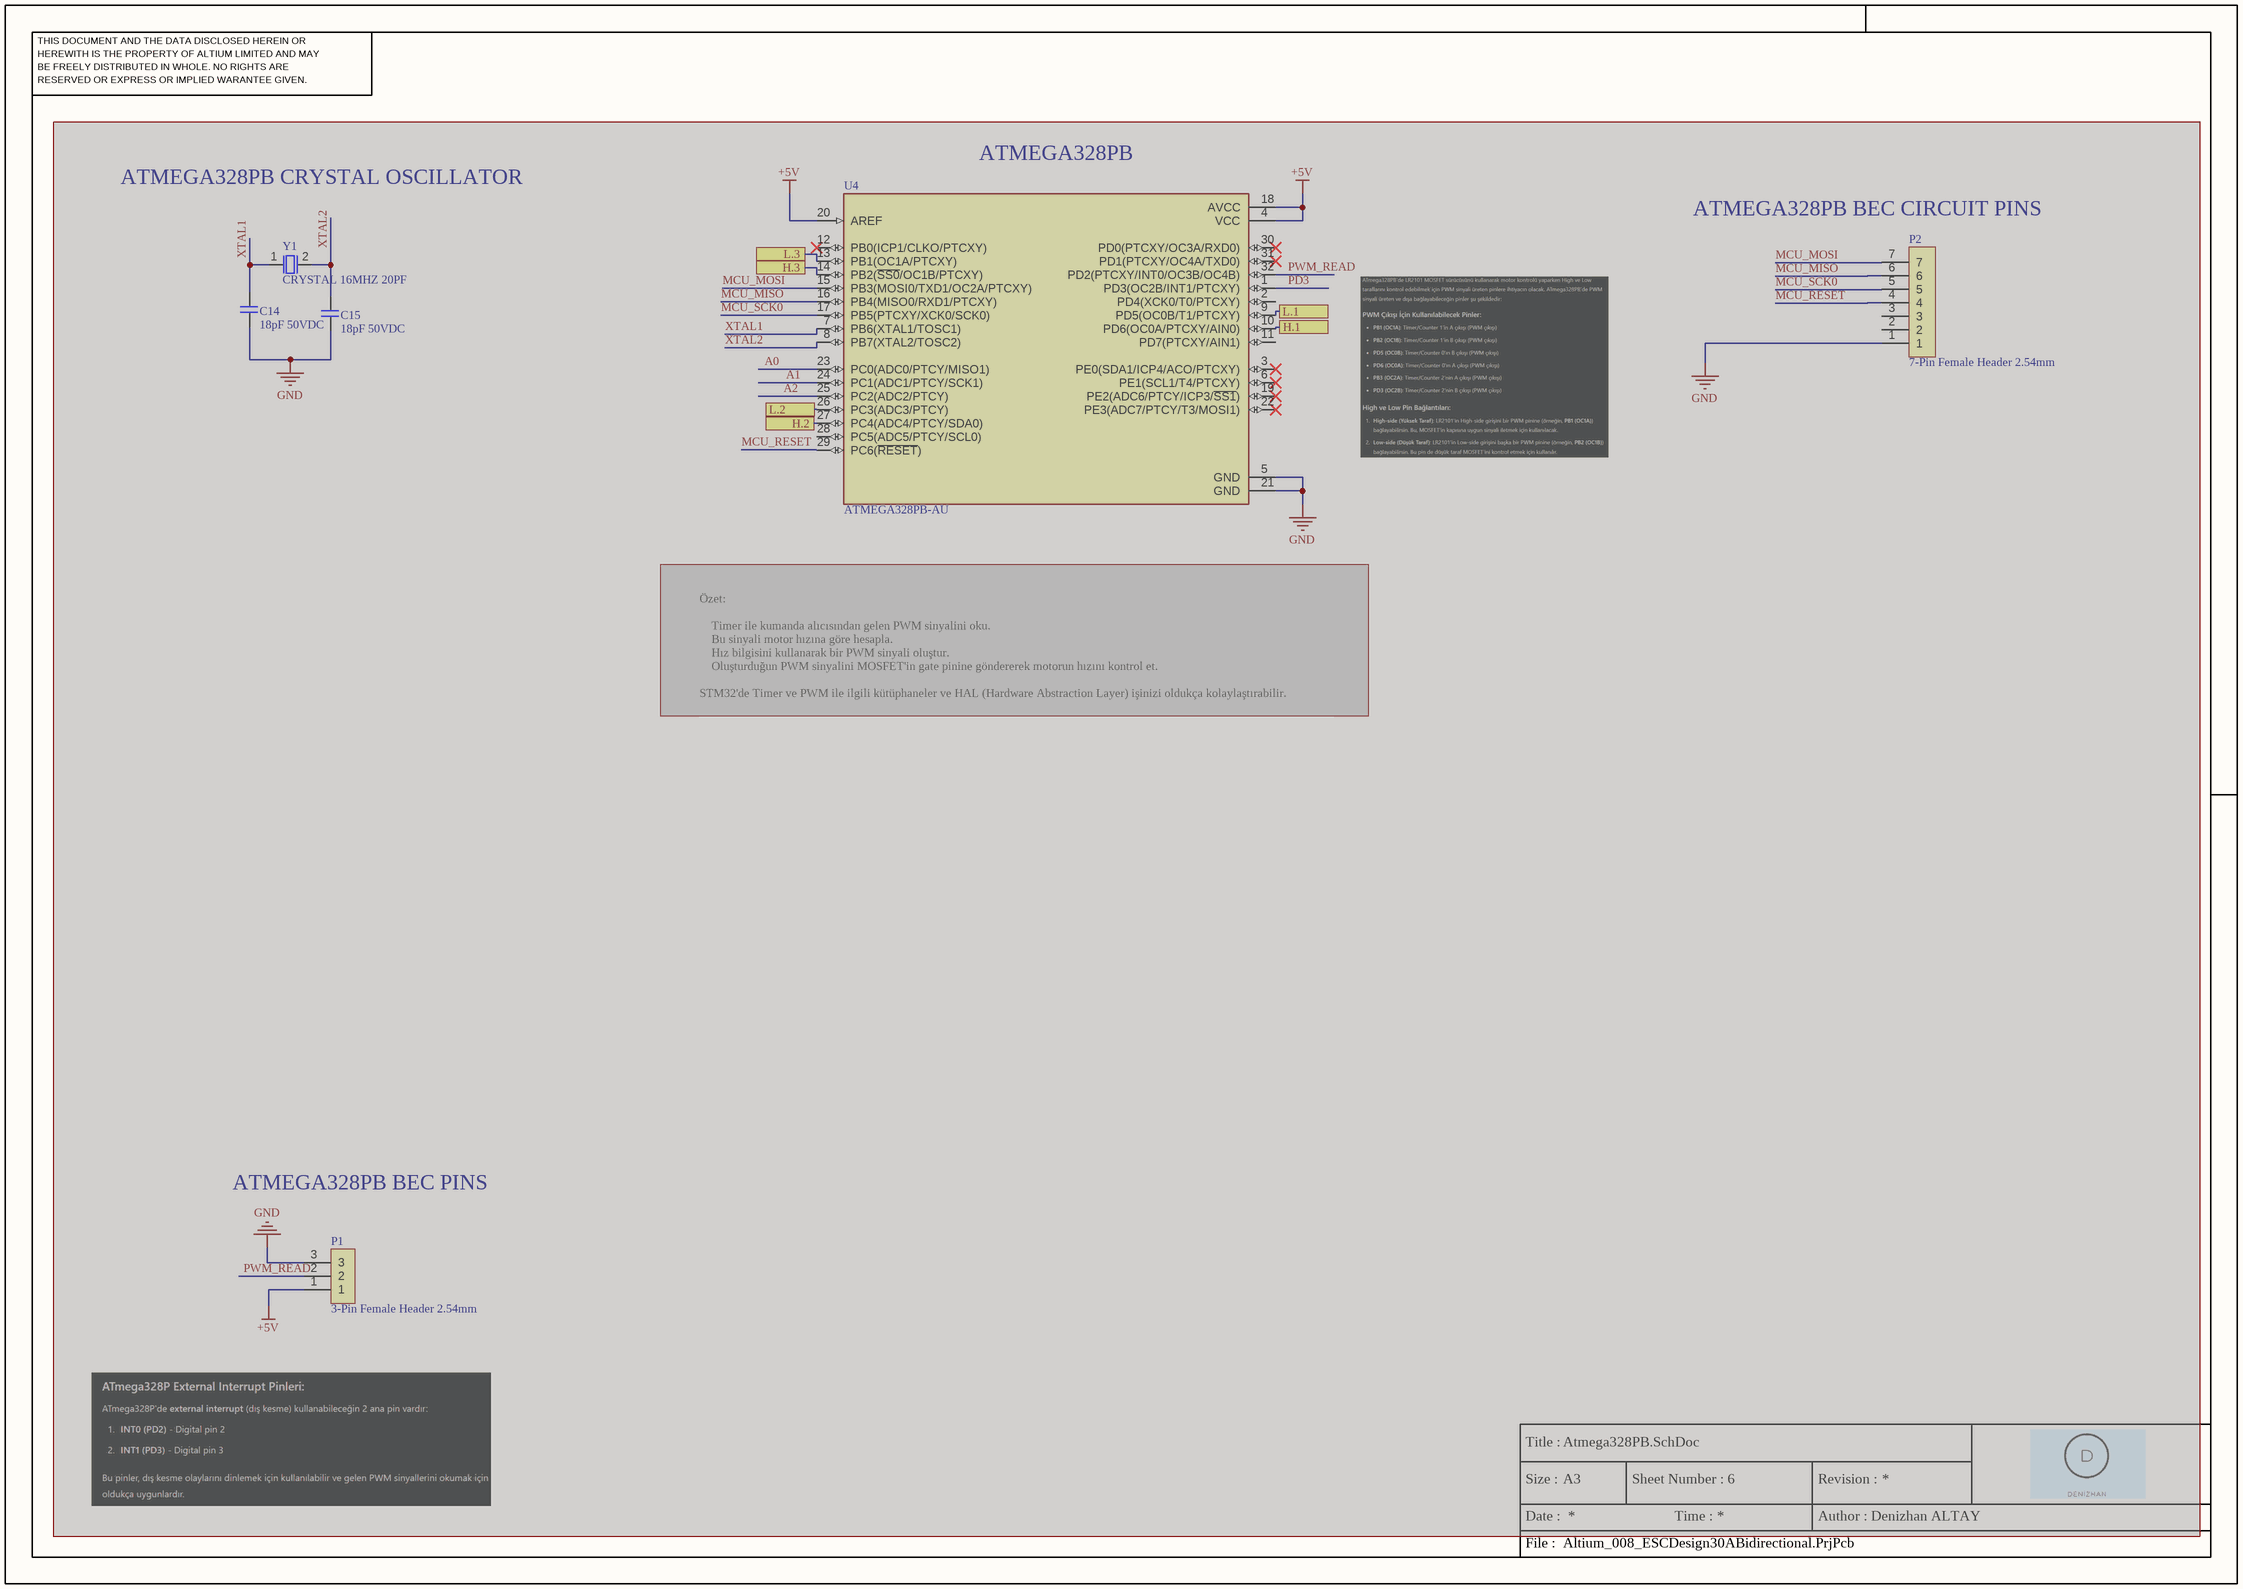
[diagram p5: Atmega328PB.SchDoc]

### Parts
C14  18pF 50VDC  [0603_UNP_Cap]  (masked out: inside a compile mask, not in the netlist)
C15  18pF 50VDC  [0603_UNP_Cap]  (masked out: inside a compile mask, not in the netlist)
P1  3-Pin Female Header 2.54mm  [1x3 Pin Female Header 2.54mm]  (masked out: inside a compile mask, not in the netlist)
P2  7-Pin Female Header 2.54mm  [Single 7-Pin (2.54mm) Female Header]  (masked out: inside a compile mask, not in the netlist)
U4  ATMEGA328PB-AU  [ATMEGA328PB-AU]  (masked out: inside a compile mask, not in the netlist)
Y1  CRYSTAL 16MHZ 20PF  [16MHZ_CrsytalOscillator]  (masked out: inside a compile mask, not in the netlist)

### Ports
H.1 (see MosfetDrivers[1B]), H.2 (see MosfetDrivers[1C]), H.3 (see MosfetDrivers[3B]), L.1 (see MosfetDrivers[1B]), L.2 (see MosfetDrivers[1C]), L.3 (see MosfetDrivers[3B])

### Notes on the sheet
- ATMEGA328PB CRYSTAL OSCILLATOR
- (near U4) ATMEGA328PB
- (near P2) ATMEGA328PB BEC CIRCUIT PINS
- Özet:
  Timer ile kumanda alıcısından gelen PWM sinyalini oku.
  Bu sinyali motor hızına göre hesapla.
  Hız bilgisini kullanarak bir PWM sinyali oluştur.
  Oluşturduğun PWM sinyalini MOSFET'in gate pinine göndererek motorun hızını kontrol et.
  STM32'de Timer ve PWM ile ilgili kütüphaneler ve HAL (Hardware Abstraction Layer) işinizi oldukça kolaylaştırabilir.
- ATMEGA328PB BEC PINS
- THIS DOCUMENT AND THE DATA DISCLOSED HEREIN OR
- HEREWITH IS THE PROPERTY OF ALTIUM LIMITED AND MAY
- BE FREELY DISTRIBUTED IN WHOLE. NO RIGHTS ARE
- RESERVED OR EXPRESS OR IMPLIED WARANTEE GIVEN.
- Title :
- Size :
- Date :
- A3
- Sheet Number :
- Time :
- Revision :
- Author :
- File :

### Library data of the parts
C14 C15 = MCF03JTN500180 - MLCC 0603 18pF 50VDC ±5% C0G (NP0): MCF03JTN500180 - MLCC (1608) 0603 18pF 50VDC ±5% C0G (NP0); Manufacturer: VIKING; Part Number: MCF03MTX250106; Capacitor Type: Ceramic; Library Ref: Capacitors; Package / Case: 0603; Capacitor Value: 18pF; ComponentLink1Description: New link; ComponentLink1URL: https://www.ozdisan.com/passive-components/resistors/smt-smd-and-chip-resistors/PS03W4F1003T5E/592727; Max Working Voltage: 50VDC
P1 = Single 3-Pin (2.54mm) Female Header: Library Ref: Header
P2 = Single 7-Pin (2.54mm) Female Header: Library Ref: Header
U4 = ATMEGA328PB-AU: ATmega Series 20 MHz 32 KB Flash 2 KB SRAM 8-Bit Microcontroller - TQFP-32; MF: {'manufacturer': u'Microchip Technology'}; Price: None; Availability: Unavailable; Package / Case: SMD; Library Ref: Microprocessors; Name: ATMEGA328PB-AU
Y1 = AS-16.000-20-SMD-TR - CRYSTAL 16.0000MHZ 20PF SMD: Button Size: 12mm; Library Ref: Oscillator; Package / Case: SMD; Oscillator Type: Crystal; Part Number: AS-16.000-20-SMD-TR

## Nets that join several sheets
VBAT: Buck Converter and BEC Systems (C?#1.1 IC?#1.3 L?#1.2), Stm32F103C8T6 (13 pins)
VCC: Buck Converter and BEC Systems (6 pins), MosfetDrivers (12 pins)
VSS-1: Buck Converter and BEC Systems (13 pins), MosfetDrivers (15 pins), Stm32F103C8T6 (15 pins)